# EAGLE design RP_Watchy (EAGLE 9.5.2)

## Sheet 1 of 3
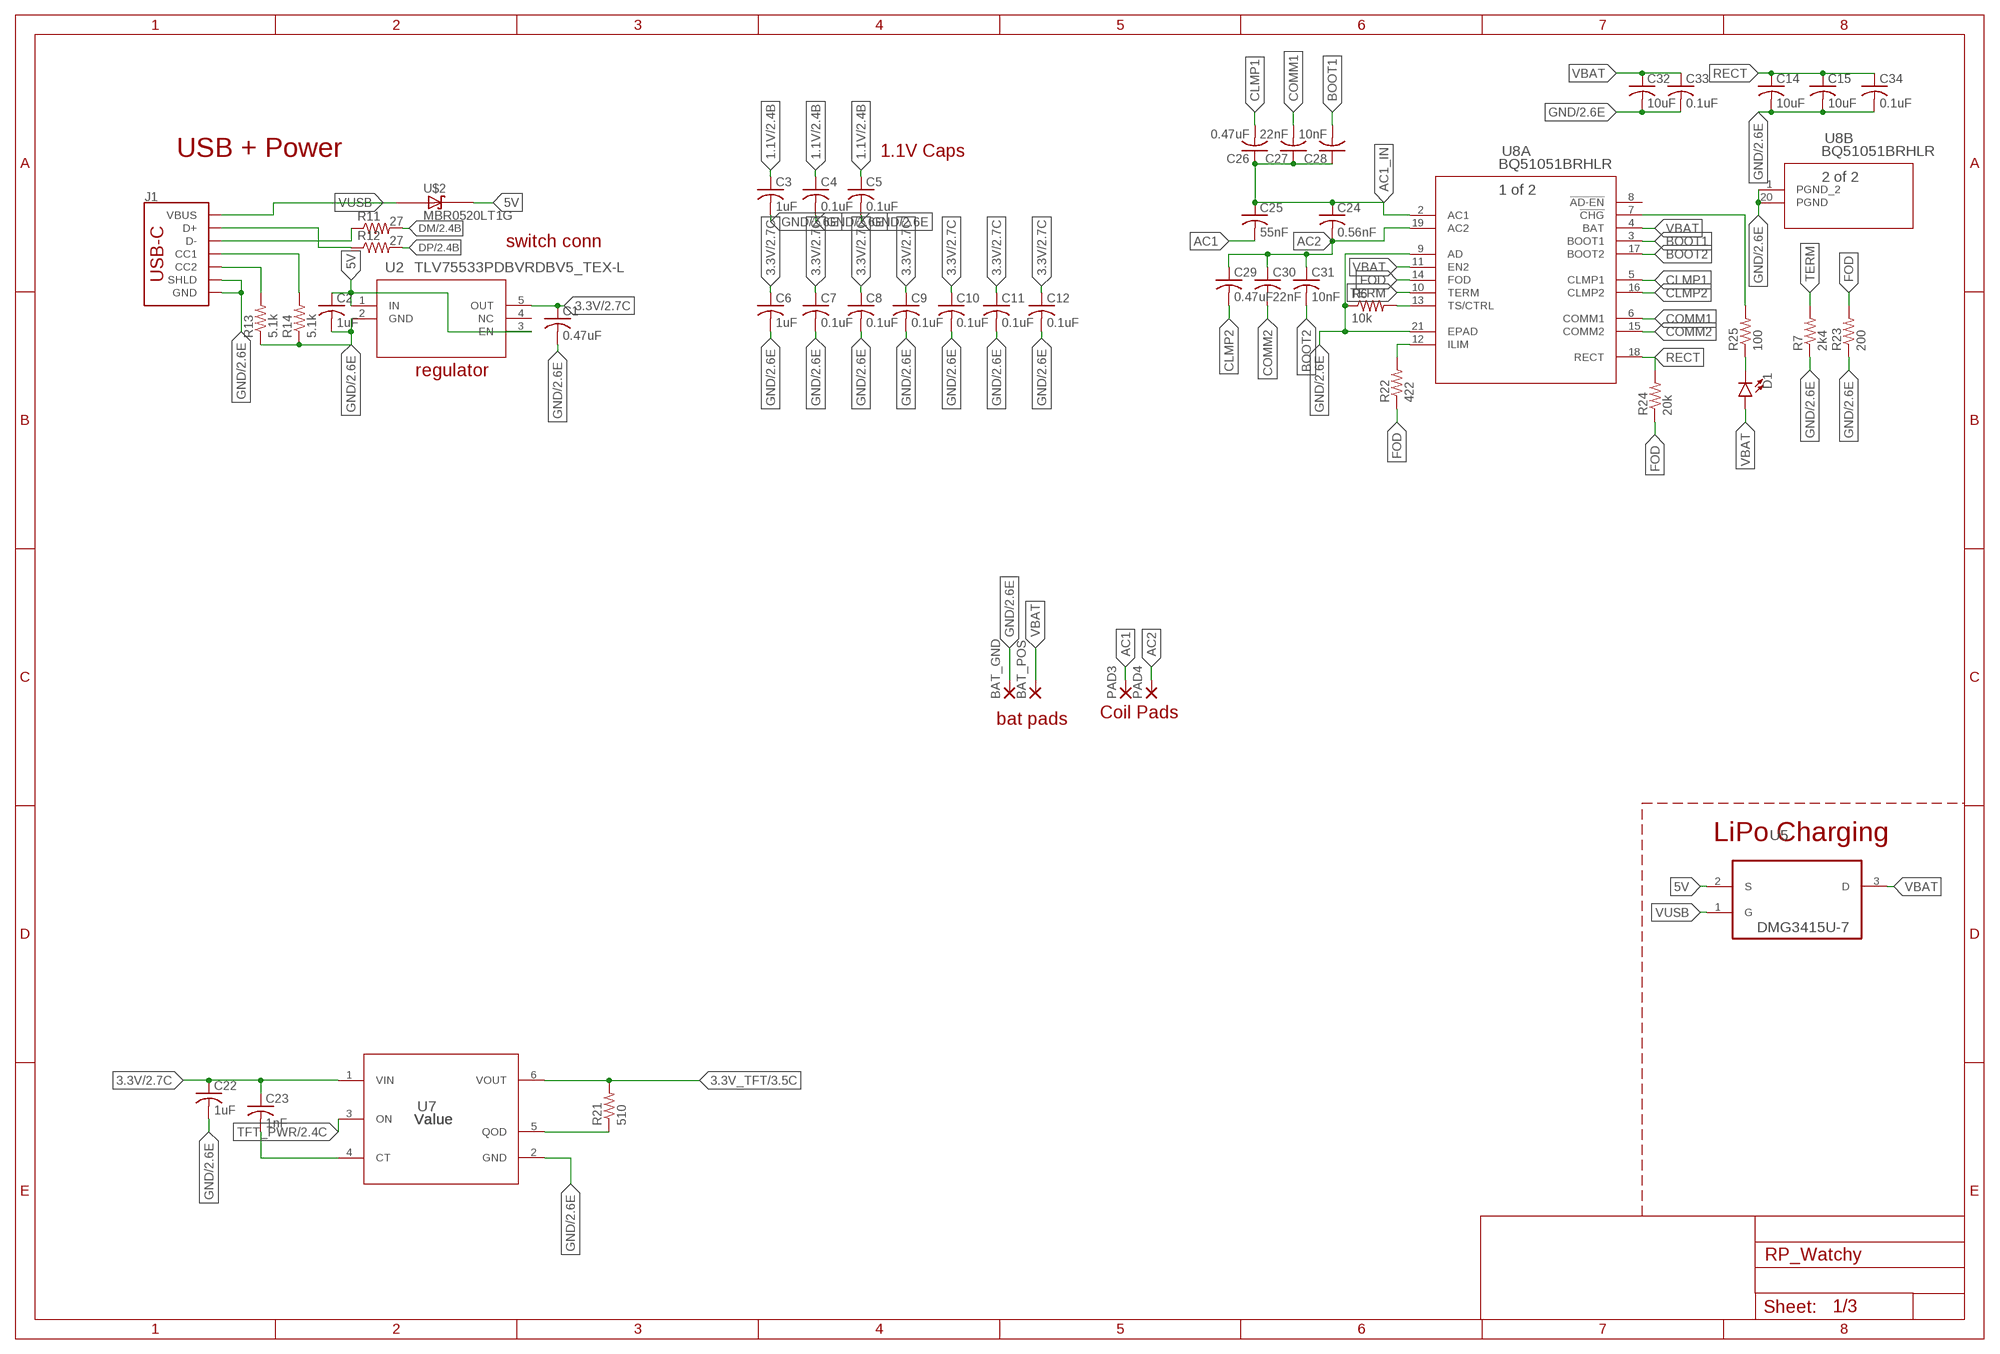
[diagram p0: schematic, sheet 1]

### Parts
BAT_GND  SMD2  [SMD1,27-2,54]
BAT_POS  SMD2  [SMD1,27-2,54]
C1  0.47uF  C-USC0402  [C0402]
C2  1uF  C-USC0402  [C0402]
C3  1uF  C-USC0402  [C0402]
C4  0.1uF  C-USC0402  [C0402]
C5  0.1uF  C-USC0402  [C0402]
C6  1uF  C-USC0402  [C0402]
C7  0.1uF  C-USC0402  [C0402]
C8  0.1uF  C-USC0402  [C0402]
C9  0.1uF  C-USC0402  [C0402]
C10  0.1uF  C-USC0402  [C0402]
C11  0.1uF  C-USC0402  [C0402]
C12  0.1uF  C-USC0402  [C0402]
C14  10uF  C-USC0402  [C0402]
C15  10uF  C-USC0402  [C0402]
C22  1uF  C-USC0402  [C0402]
C23  1nF  C-USC0402  [C0402]
C24  0.56nF  C-USC0603  [C0603]
C25  55nF  C-USC0603  [C0603]
C26  0.47uF  C-USC0402  [C0402]
C27  22nF  C-USC0402  [C0402]
C28  10nF  C-USC0402  [C0402]
C29  0.47uF  C-USC0402  [C0402]
C30  22nF  C-USC0402  [C0402]
C31  10nF  C-USC0402  [C0402]
C32  10uF  C-USC0402  [C0402]
C33  0.1uF  C-USC0402  [C0402]
C34  0.1uF  C-USC0402  [C0402]
D1  LED0603  [LED-0603]
J1  USB_C_2-LAYER_PADS  [USB-C-16P-2LAYER-PADS]
PAD3  SMD2  [SMD1,27-2,54]
PAD4  SMD2  [SMD1,27-2,54]
R6  10k  R-US_R0402  [R0402]
R7  2k4  R-US_R0402  [R0402]
R11  27  R-US_R0603  [R0603]
R12  27  R-US_R0603  [R0603]
R13  5.1k  R-US_R0603  [R0603]
R14  5.1k  R-US_R0603  [R0603]
R21  510  R-US_R0402  [R0402]
R22  422  R-US_R0402  [R0402]
R23  200  R-US_R0402  [R0402]
R24  20k  R-US_R0402  [R0402]
R25  100  R-US_R0402  [R0402]
U2  TLV75533PDBVRDBV5_TEX-L  [DBV5_TEX-L]
U5  DMG3415U-7  [SOT95P240X105-3N]
U7  Value  TPS22917DBVRDBV0006_L  [DBV0006_L]
U8  BQ51051BRHLR  [RHL20_2P05X3P05]
U$2  MBR0520LT1G  [SOD3716X117(SOD-123)]

### Nets
1.1V: C3.1 C4.1 C5.1 ; also sheet 2
3.3V: C1.1 C6.1 C7.1 C8.1 C9.1 C10.1 C11.1 C12.1 C22.1 C23.1 U2.5(OUT) U7.1(VIN) ; also sheet 2
3.3V_TFT: R21.2 U7.6(VOUT) ; also sheet 3
5V: C2.1 U2.1(IN) U2.3(EN) U5.2(S) U$2.1(C)
AC1: C25.2 PAD3.1(P)
AC1_IN: C24.1 C25.1 C26.1 C27.1 C28.1 U8.2(A:AC1)
AC2: C24.2 C29.1 C30.1 C31.1 PAD4.1(P) U8.19(A:AC2)
BOOT1: C28.2 U8.3(A:BOOT1)
BOOT2: C31.2 U8.17(A:BOOT2)
CLMP1: C26.2 U8.5(A:CLMP1)
CLMP2: C29.2 U8.16(A:CLMP2)
COMM1: C27.2 U8.6(A:COMM1)
COMM2: C30.2 U8.15(A:COMM2)
DM: R11.2 ; also sheet 2
DP: R12.2 ; also sheet 2
FOD: R22.1 R23.2 R24.1 U8.14(A:FOD)
GND: BAT_GND.1(P) C1.2 C2.2 C3.2 C4.2 C5.2 C6.2 C7.2 C8.2 C9.2 C10.2 C11.2 C12.2 C14.2 C15.2 C22.2 C32.2 C33.2 C34.2 J1.GND J1.GND2(GND) J1.P$1(SHLD) J1.P$2(SHLD) J1.P$3(SHLD) J1.P$4(SHLD) J1.SHLD1(SHLD) J1.SHLD2(SHLD) J1.SHLD3(SHLD) J1.SHLD4(SHLD) R6.1 R7.1 R13.1 R14.1 R23.1 U2.2(GND) U7.2(GND) U8.1(B:PGND_2) U8.9(A:AD) U8.20(B:PGND) U8.21(A:EPAD) ; also sheet 2,3
N$1: R6.2 U8.13(A:TS/CTRL)
N$3: J1.A5(CC1) R14.2
N$4: J1.B5(CC2) R13.2
N$7: C23.2 U7.4(CT)
N$8: R21.1 U7.5(QOD)
N$9: R22.2 U8.12(A:ILIM)
N$10: J1.A7(D-) J1.B7(D-) R11.1
N$11: J1.A6(D+) J1.B6(D+) R12.1
N$12: R25.2 U8.7(A:!CHG)
N$13: D1.C R25.1
RECT: C14.1 C15.1 C34.1 R24.2 U8.18(A:RECT)
TERM: R7.2 U8.10(A:TERM)
TFT_PWR: U7.3(ON) ; also sheet 2
VBAT: BAT_POS.1(P) C32.1 C33.1 D1.A U5.3(D) U8.4(A:BAT) U8.11(A:EN2)
VUSB: J1.VBUS1(VBUS) J1.VBUS2(VBUS) U5.1(G) U$2.2(A)
Unconnected: U2.4(NC) U8.8(A:!AD-EN)

### Notes on the sheet
- USB + Power | 1.1V Caps
- switch conn
- regulator
- Coil Pads
- bat pads
- LiPo Charging

## Sheet 2 of 3
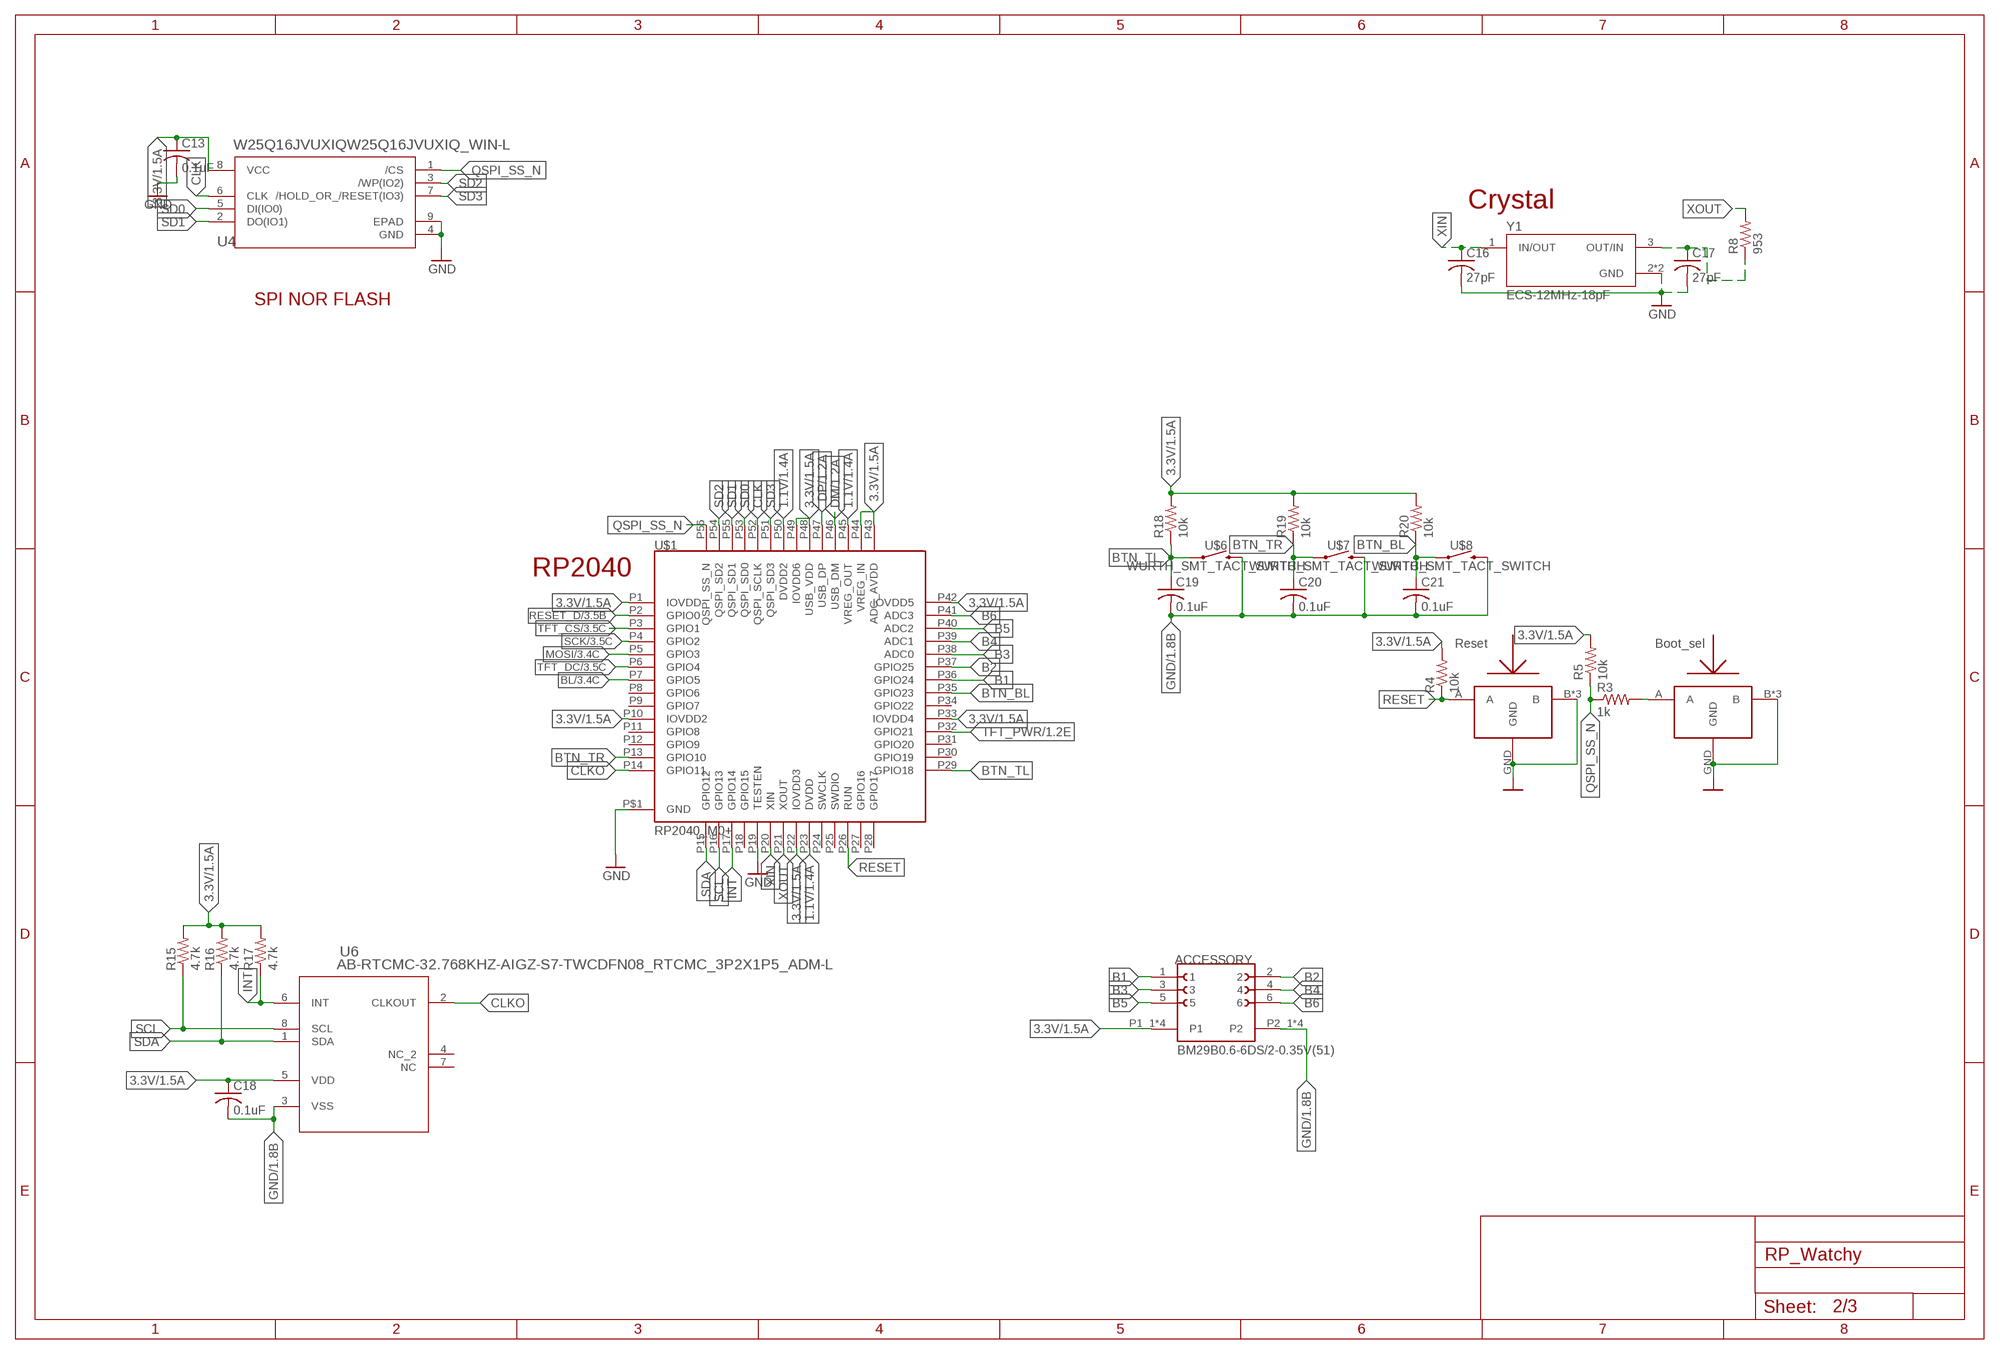
[diagram p1: schematic, sheet 2]

### Parts
ACCESSORY  BM29B0.6-6DS/2-0.35V(51)  [HRS_BM29B0.6-6DS/2-0.35V(51)]
C13  0.1uF  C-USC0402  [C0402]
C16  27pF  C-USC0402  [C0402]
C17  27pF  C-USC0402  [C0402]
C18  0.1uF  C-USC0402  [C0402]
C19  0.1uF  C-USC0402  [C0402]
C20  0.1uF  C-USC0402  [C0402]
C21  0.1uF  C-USC0402  [C0402]
R3  1k  R-US_R0402  [R0402]
R4  10k  R-US_R0402  [R0402]
R5  10k  R-US_R0402  [R0402]
R8  953  R-US_R0402  [R0402]
R15  4.7k  R-US_R0402  [R0402]
R16  4.7k  R-US_R0402  [R0402]
R17  4.7k  R-US_R0402  [R0402]
R18  10k  R-US_R0402  [R0402]
R19  10k  R-US_R0402  [R0402]
R20  10k  R-US_R0402  [R0402]
U4  W25Q16JVUXIQW25Q16JVUXIQ_WIN-L  [W25Q16JVUXIQ_WIN-L]
U6  AB-RTCMC-32.768KHZ-AIGZ-S7-TWCDFN08_RTCMC_3P2X1P5_ADM-L  [WCDFN08_RTCMC_3P2X1P5_ADM-L]
U$1  RP2040_M0+  [QFN-56]
U$4  SOF-232HST  [3.3X2.9]
U$5  SOF-232HST  [3.3X2.9]
U$6  WURTH_SMT_TACT_SWITCH  [SIDE_MOUNT_SWITCH]
U$7  WURTH_SMT_TACT_SWITCH  [SIDE_MOUNT_SWITCH]
U$8  WURTH_SMT_TACT_SWITCH  [SIDE_MOUNT_SWITCH]
Y1  ECS-12MHz-18pF  ECS-327ATQMV-AS-TR  [XTAL_ECS-327ATQMV-AS-TR]

### Nets
1.1V: U$1.P23(DVDD) U$1.P45(VREG_OUT) U$1.P50(DVDD2) ; also sheet 1
3.3V: ACCESSORY.P1_1(P1) ACCESSORY.P1_2(P1) ACCESSORY.P1_3(P1) ACCESSORY.P1_4(P1) C13.1 C18.1 R4.2 R5.2 R15.2 R16.2 R17.2 R18.2 R19.2 R20.2 U4.8(VCC) U6.5(VDD) U$1.P1(IOVDD) U$1.P10(IOVDD2) U$1.P22(IOVDD3) U$1.P33(IOVDD4) U$1.P42(IOVDD5) U$1.P43(ADC_AVDD) U$1.P44(VREG_IN) U$1.P48(USB_VDD) U$1.P49(IOVDD6) ; also sheet 1
B1: ACCESSORY.1 U$1.P36(GPIO24)
B2: ACCESSORY.2 U$1.P37(GPIO25)
B3: ACCESSORY.3 U$1.P38(ADC0)
B4: ACCESSORY.4 U$1.P39(ADC1)
B5: ACCESSORY.5 U$1.P40(ADC2)
B6: ACCESSORY.6 U$1.P41(ADC3)
BL: U$1.P7(GPIO5) ; also sheet 3
BTN_BL: C21.1 R20.1 U$1.P35(GPIO23) U$8.1
BTN_TL: C19.1 R18.1 U$1.P29(GPIO18) U$6.1
BTN_TR: C20.1 R19.1 U$1.P13(GPIO10) U$7.1
CLK: U4.6(CLK) U$1.P52(QSPI_SCLK)
CLKO: U6.2(CLKOUT) U$1.P14(GPIO11)
DM: U$1.P46(USB_DM) ; also sheet 1
DP: U$1.P47(USB_DP) ; also sheet 1
GND: ACCESSORY.P2_1(P2) ACCESSORY.P2_2(P2) ACCESSORY.P2_3(P2) ACCESSORY.P2_4(P2) C13.2 C16.2 C17.2 C18.2 C19.2 C20.2 C21.2 U4.4(GND) U4.9(EPAD) U6.3(VSS) U$1.P19(TESTEN) U$1.P$1(GND) U$4.B U$4.B2(B) U$4.B3(B) U$4.GND U$5.B U$5.B2(B) U$5.B3(B) U$5.GND U$6.2 U$7.2 U$8.2 Y1.2(GND) Y1.4(GND) ; also sheet 1,3
INT: R17.1 U6.6(INT) U$1.P17(GPIO14)
MOSI: U$1.P5(GPIO3) ; also sheet 3
N$2: R3.2 U$5.A
N$6: C17.1 R8.1 Y1.3(OUT/IN)
QSPI_SS_N: R3.1 R5.1 U4.1(/CS) U$1.P56(QSPI_SS_N)
RESET: R4.1 U$1.P26(RUN) U$4.A
RESET_D: U$1.P2(GPIO0) ; also sheet 3
SCK: U$1.P4(GPIO2) ; also sheet 3
SCL: R15.1 U6.8(SCL) U$1.P16(GPIO13)
SD0: U4.5(DI(IO0)) U$1.P53(QSPI_SD0)
SD1: U4.2(DO(IO1)) U$1.P55(QSPI_SD1)
SD2: U4.3(/WP(IO2)) U$1.P54(QSPI_SD2)
SD3: U4.7(/HOLD_OR_/RESET(IO3)) U$1.P51(QSPI_SD3)
SDA: R16.1 U6.1(SDA) U$1.P15(GPIO12)
TFT_CS: U$1.P3(GPIO1) ; also sheet 3
TFT_DC: U$1.P6(GPIO4) ; also sheet 3
TFT_PWR: U$1.P32(GPIO21) ; also sheet 1
XIN: C16.1 U$1.P20(XIN) Y1.1(IN/OUT)
XOUT: R8.2 U$1.P21(XOUT)
Unconnected: U6.4(NC_2) U6.7(NC) U$1.P8(GPIO6) U$1.P9(GPIO7) U$1.P11(GPIO8) U$1.P12(GPIO9) U$1.P18(GPIO15) U$1.P24(SWCLK) U$1.P25(SWDIO) U$1.P27(GPIO16) U$1.P28(GPIO17) U$1.P30(GPIO19) U$1.P31(GPIO20) U$1.P34(GPIO22)

### Notes on the sheet
- Crystal
- SPI NOR FLASH
- RP2040
- Reset | Boot_sel

## Sheet 3 of 3
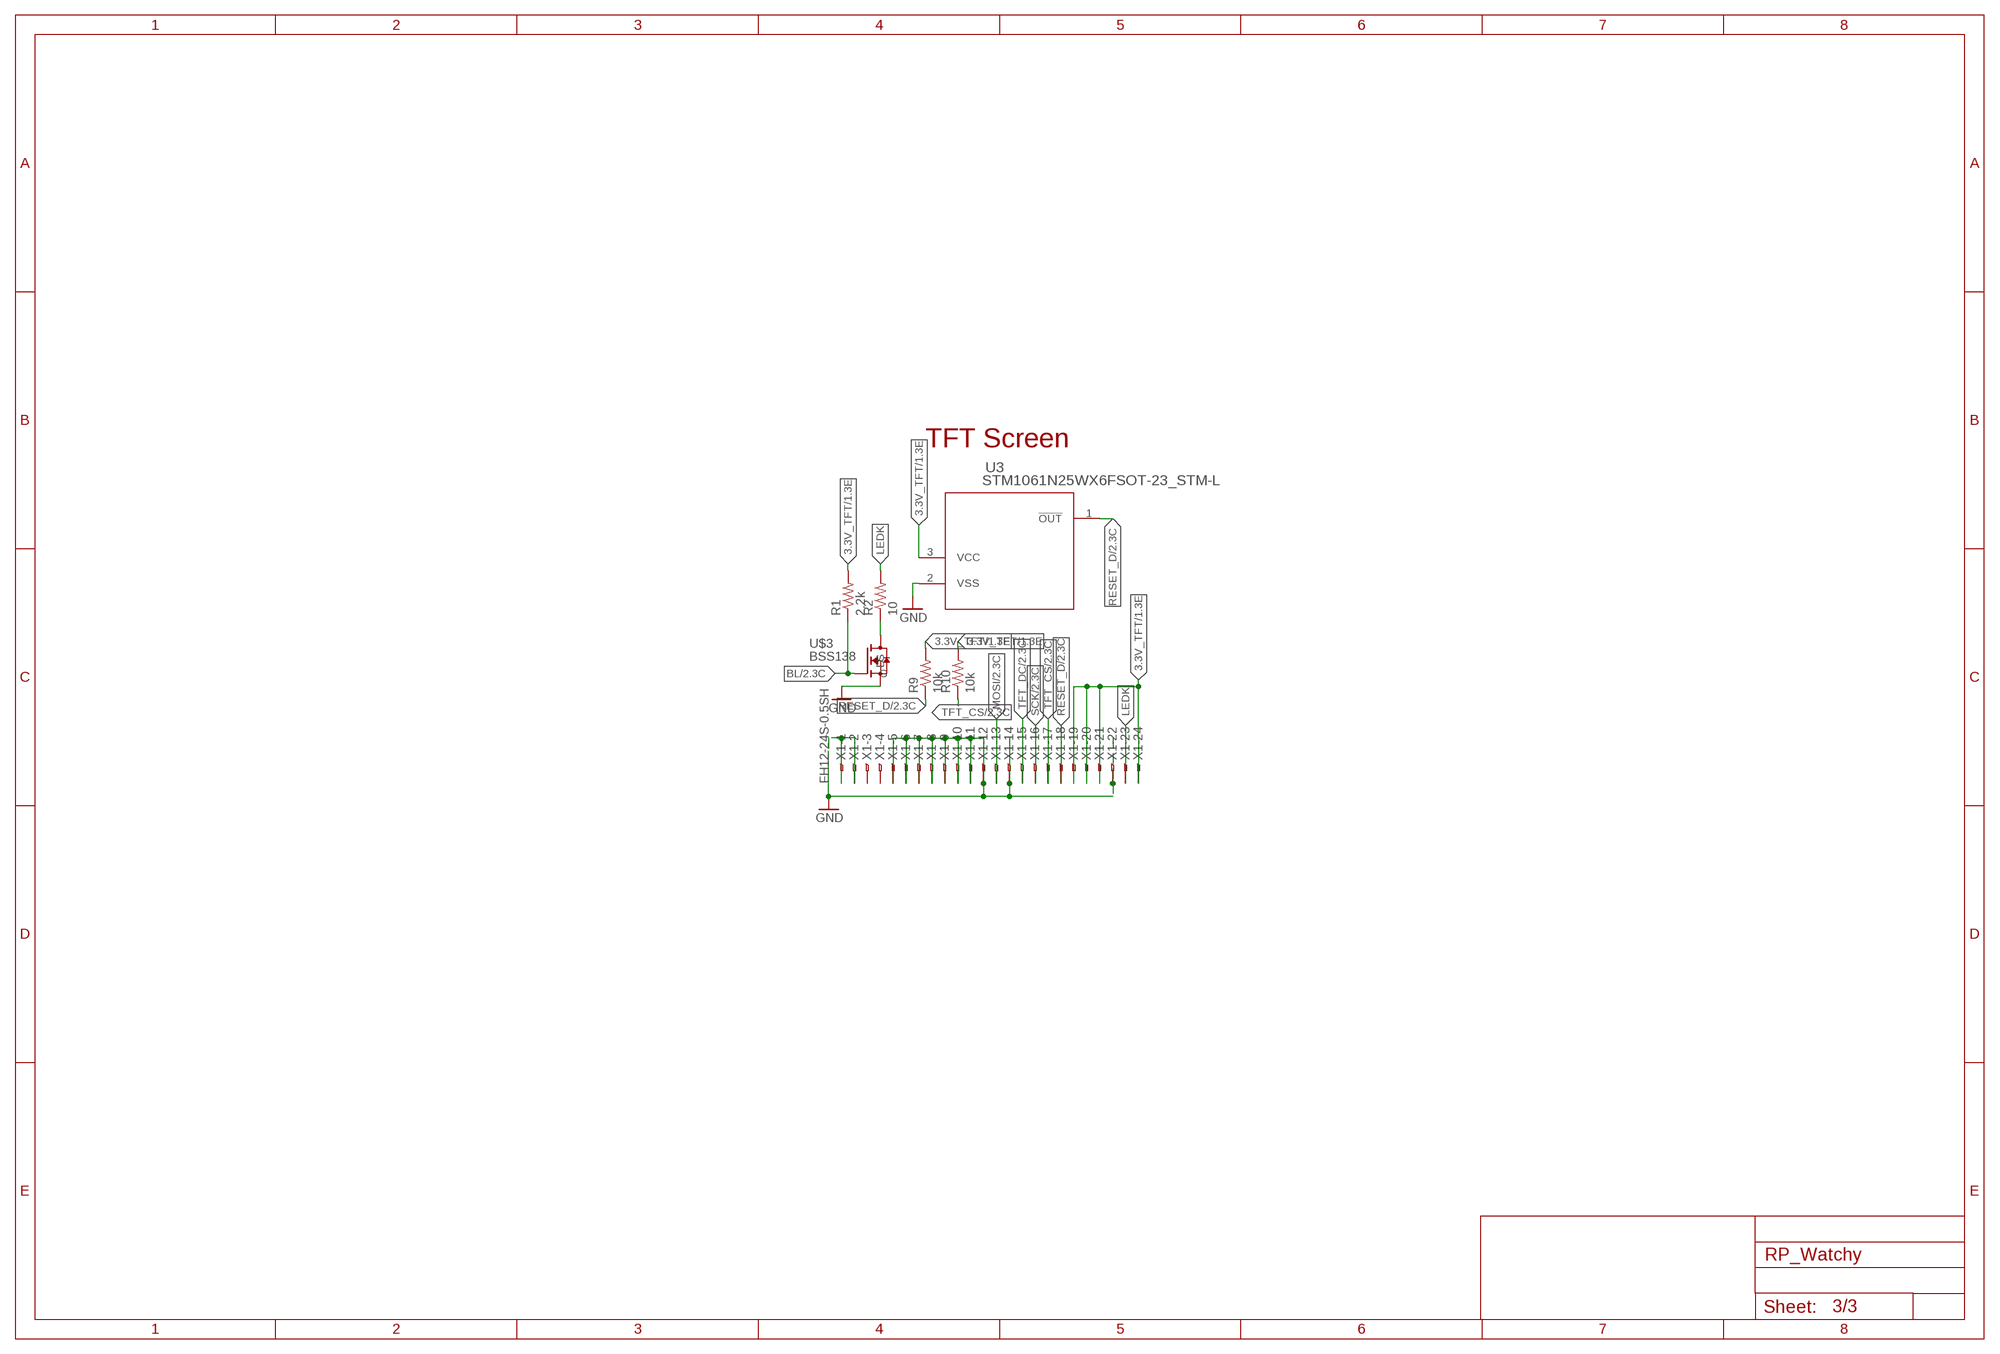
[diagram p2: schematic, sheet 3]

### Parts
R1  2.2k  R-US_R0603  [R0603]
R2  10  R-US_R0402  [R0402]
R9  10k  R-US_R0402  [R0402]
R10  10k  R-US_R0402  [R0402]
U3  STM1061N25WX6FSOT-23_STM-L  [SOT-23_STM-L]
U$3  BSS138  [BSS138]
X1  FH12-24S-0.5SH  [FH12-24S-0.5SH]

### Nets
3.3V_TFT: R1.2 R9.2 R10.2 U3.3(VCC) X1.19 X1.20 X1.21 X1.24 ; also sheet 1
BL: R1.1 U$3.G ; also sheet 2
GND: U3.2(VSS) U$3.S X1.1 X1.2 X1.5 X1.6 X1.7 X1.8 X1.9 X1.10 X1.11 X1.12 X1.14 X1.22 ; also sheet 1,2
LEDK: R2.2 X1.23
MOSI: X1.13 ; also sheet 2
N$5: R2.1 U$3.D
RESET_D: R9.1 U3.1(!OUT) X1.18 ; also sheet 2
SCK: X1.16 ; also sheet 2
TFT_CS: R10.1 X1.17 ; also sheet 2
TFT_DC: X1.15 ; also sheet 2
Unconnected: X1.3 X1.4

### Notes on the sheet
- TFT Screen

## Library data of the parts
ACCESSORY = BM29B0.6-6DS_2-0.35V_51_:BM29B0.6-6DS/2-0.35V(51); DESCRIPTION: 8 (6 + 2 Power) Position Connector Receptacle, Center Strip Contacts Surface Mount Gold; DIGI-KEY_PART_NUMBER: 26-BM29B0.6-6DS/2-0.35V(51)TR-ND; MF: Hirose Connector; MP: BM29B0.6-6DS/2-0.35V(51); PACKAGE: None; PURCHASE-URL: https://pricing.snapeda.com/search/part/BM29B0.6-6DS/2-0.35V(51)/?ref=eda
BAT_GND BAT_POS PAD3 PAD4 = wirepad:SMD2: SMD PAD
C1-C13 C16-C23 = rcl:C-US: CAPACITOR, American symbol; SPICEPREFIX: C
C14 C15 C24-C34 = adafruit:C-US: CAPACITOR, American symbol
D1 = SparkFun-LED:LED: LED (Generic) Standard schematic elements and footprints for 5mm, 3mm, 1206, and 0603 sized LEDs. Generic LEDs with no color specified.
J1 = SparkFun-Connectors:USB_C: USB Type C 16Pin Connector Super Speed pins not available on the 16-pin purely SMD connector so this part is best for USB 2.0 implementations. D1 and D2 are tied together enabling D+/- no matter which way the cable is plugged into the connector. The two channel configuration pins (CC1/2) are exposed. These are normally connected to ground via 5.1k resistors but can be reconfigured for high current/high power applications.; PROD_ID: CONN-14122
R1-R25 = rcl:R-US_: RESISTOR, American symbol; SPICEPREFIX: R
U2 = TLV75533pdbvr:TLV75533PDBVR; COPYRIGHT: Copyright (C) 2018 Accelerated Designs. All rights reserved; MANUFACTURER_PART_NUMBER: TLV75533PDBVR; SOURCELIBRARY: TI_2019-06-18; VENDOR: Texas Instruments
U3 = STM Devices:STM1061N25WX6F; COPYRIGHT: Copyright (C) 2021 Ultra Librarian. All rights reserved.; DIGI-KEY_PART_NUMBER_1: 1026-STM1061N25WX6F-CHP; DIGI-KEY_PART_NUMBER_2: 497-6181-1-ND; DIGI-KEY_PART_NUMBER_3: 497-6181-2-ND; DIGI-KEY_PART_NUMBER_4: 497-6181-6-ND; MANUFACTURER_PART_NUMBER: STM1061N25WX6F; MFR_NAME: STMicroelectronics
U4 = Winbond SPI Flash:W25Q16JVUXIQ; BUILT_BY: EMA_Colton; COPYRIGHT: Copyright (C) 2018 Accelerated Designs. All rights reserved; DATASHEET: https://www.mouser.com/datasheet/2/949/w25n01gw_reve_021318_unsecured-1489855.pdf; MANUFACTURER_PART_NUMBER: W25Q16JVUXIQ; SOURCELIBRARY: Winbond_2020-03-18; VENDOR: Winbond
U5 = DMG3415U-7:DMG3415U-7: P-CHANNEL ENHANCEMENT MODE MOSFET; AVAILABILITY: Unavailable; DESCRIPTION: P-Channel 20V 4A _Ta_ 900mW _Ta_ Surface Mount SOT-23-3; MF: Diodes Inc.; MP: DMG3415U-7; PACKAGE: SOT-23-3 Diodes Inc.; PRICE: None
U6 = Abracon RTC:AB-RTCMC-32.768KHZ-AIGZ-S7-T; COPYRIGHT: Copyright (C) 2022 Ultra Librarian. All rights reserved.; DIGI-KEY_PART_NUMBER_1: 535-12052-2-ND; DIGI-KEY_PART_NUMBER_2: 535-12052-1-ND; DIGI-KEY_PART_NUMBER_3: 535-12052-6-ND; DIGI-KEY_PART_NUMBER_4: 535-12052-2-NDL; MANUFACTURER_PART_NUMBER: AB-RTCMC-32.768KHZ-AIGZ-S7-T; MFR_NAME: Abracon
U7 = TPS22917DBVR:TPS22917DBVR; MANUFACTURER: Texas Instruments; PARTNUMBER: TPS22917DBVR; REFDES: RefDes; TYPE: TYPE
U8 = BQ51051BRHLR:BQ51051BRHLR; COPYRIGHT: Copyright (C) 2022 Ultra Librarian. All rights reserved.; MANUFACTURER_PART_NUMBER: BQ51051BRHLR; MFR_NAME: Texas Instruments
U$1 = RP2040_M0:RP2040_M0+
U$2 = MBR0520LT1G:MBR0520LT1G: Surface Mount Schottky Power Rectifier Plastic SOD−123 Package; AVAILABILITY: Unavailable; DESCRIPTION: Diode Schottky 20V 500mA Surface Mount SOD-123; MF: ON Semiconductor; MP: MBR0520LT1G; PACKAGE: SOD-123 ON Semiconductor; PRICE: None
U$3 = BSS138:BSS138: BSS138 N-Channel Logic Level Enhancement Mode Field Effect Transistor; AVAILABILITY: Unavailable; DESCRIPTION: N-Channel 50V 220mA _Ta_ 360mW _Ta_ Surface Mount Die; MF: MICROSS/On Semiconductor; MP: BSS138; PACKAGE: TO-236-3 Micross; PRICE: None
U$4 U$5 = Mitsumi Buttons:SOF-232HST
U$6-U$8 = Wurth Switches:WURTH_SMT_TACT_SWITCH
X1 = con-hirose:FH12-24S-0.5S: 0.5mm Pitch Connectors For FPC/FFC Source: Data sheet <http://www.hirose.co.jp/cataloge_hp/e58605370.pdf>; MPN: FH12-24S-0.5SH(55); OC_FARNELL: 1324552; OC_NEWARK: 34M6170
Y1 = ECS-327ATQMV-AS-TR:ECS-327ATQMV-AS-TR: The ECX-33Q is a miniature SMD Crystal with a 3.2 x 2.5 mm footprint. AEC-Q200 Qualified.; ARROW_ELECTRONICS-PURCHASE-URL: https://snapeda.com/shop?store=Arrow+Electronics&id=3210300; DESCRIPTION: 32.768kHz XO (Standard) CMOS Oscillator 1.62V ~ 3.63V Enable/Disable 4-SMD, No Lead; DIGI-KEY_PART_NUMBER: XC2826CT-ND; MF: ECS Inc.; MOUSER-PURCHASE-URL: https://snapeda.com/shop?store=Mouser&id=3210300; MP: ECS-327ATQMV-AS-TR; PACKAGE: SMD-4 ECS Inc.

## Board
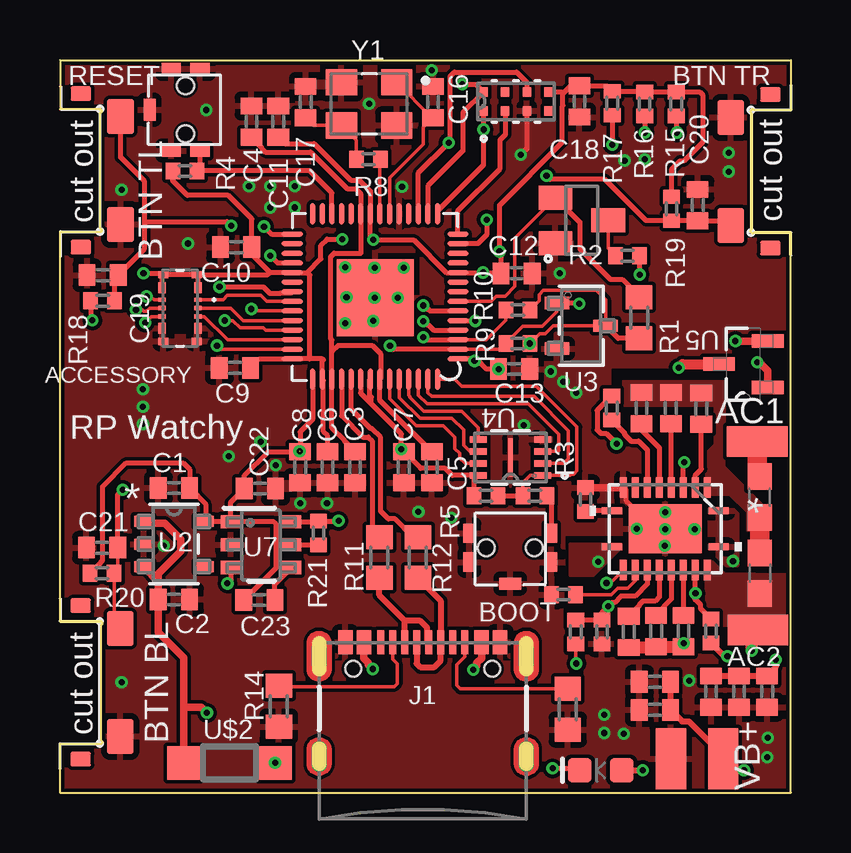
[diagram p3: board, top side]
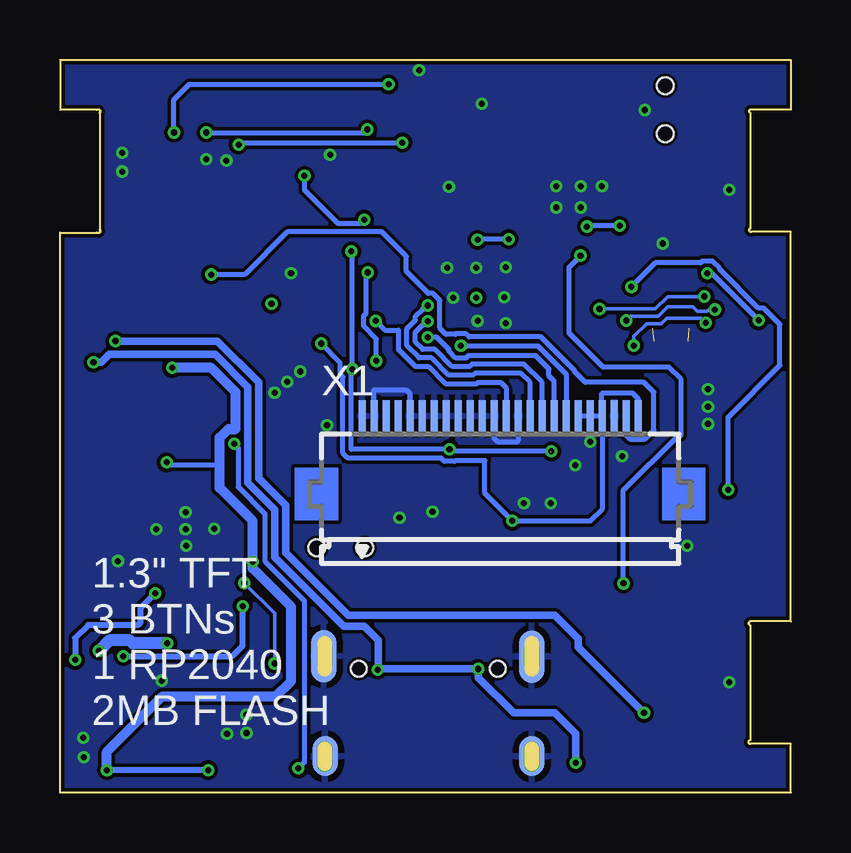
[diagram p4: board, bottom side, seen from below]

Size 30.45 x 30.53 mm. Coordinates in mm from the lower left corner, seen from the top.
Outline: 0,0 0,2.03 1.68,2.03 arc180 1.7,2.18 1.7,6.99 arc180 1.68,7.14 0,7.14 0,23.37 1.65,23.37 arc180 1.68,23.52 1.68,28.32 arc180 1.65,28.47 0,28.47 0,30.53 30.45,30.53 30.45,28.45 28.93,28.45 arc180 28.8,28.32 28.8,23.47 arc180 28.93,23.34 30.45,23.34 30.45,0 0,0
Copper layers (1*16): Top 0.035mm / dielectric 1.5mm / Bottom 0.035mm
Design rules "default *": minimum track width 6mil, minimum drill 10mil, track to track 6mil, track to pad 6mil, pad to pad 6mil, via to via 6mil, smd to smd 6mil, copper to edge 6mil, drill to drill 6mil, minimum pad ring 5mil, minimum via ring 5mil, stop-mask expansion 1mil, vias tented up to drill 12mil, thermal gap 10mil

### Footprints (pad centres in the part's own frame; a part is rotated, then mirrored left to right if it is on the bottom)
HRS_BM29B0.6-6DS/2-0.35V(51) = smd 0.18 x 0.32: 1 0.35,-0.75; 2 0.35,0.75; 3 0,-0.75; 4 0,0.75; 5 -0.35,-0.75; 6 -0.35,0.75 | smd 0.46 x 0.32: P1_1 0.84,-0.75; P1_2 0.84,0.75; P2_1 -0.84,-0.75; P2_2 -0.84,0.75 | smd 0.3 x 0.42: P1_3 1.39,-0.7; P1_4 1.39,0.7; P2_3 -1.39,-0.7; P2_4 -1.39,0.7
SMD1,27-2,54 = smd 1.27 x 2.54: 1 0,0
C0402 = smd 0.7 x 0.9: 1 -0.65,0; 2 0.65,0
C0603 = smd 1.1 x 1: 1 -0.85,0; 2 0.85,0
LED-0603 = smd 1 x 1: A -0.877,0; C 0.877,0
USB-C-16P-2LAYER-PADS = smd 0.3 x 1: A5 -1.25,-0.34; A6 -0.25,-0.34; A7 0.25,-0.34; A8 1.25,-0.34; B5 1.75,-0.34; B6 0.75,-0.34; B7 -0.75,-0.34; B8 -1.75,-0.34 | smd 0.6 x 1: GND -3.225,-0.34; GND2 3.225,-0.34; VBUS1 -2.45,-0.34; VBUS2 2.45,-0.34 | smd 1.067 x 2.184 bottom: P$1 -4.318,-0.94; P$2 4.343,-0.914 | smd 1.067 x 1.676 bottom: P$3 -4.318,-5.08; P$4 4.293,-5.08 | drill 0.4 pad 0.6 long: SHLD1 -4.318,-0.915; SHLD2 4.318,-0.915; SHLD3 -4.318,-5.095; SHLD4 4.318,-5.095 | hole 0.65: -2.89,-1.445; 2.89,-1.445
R0603 = smd 1 x 1.1: 1 -0.85,0; 2 0.85,0
R0402 = smd 0.6 x 0.7: 1 -0.5,0; 2 0.5,0
DBV5_TEX-L = smd 0.775 x 0.457: 1 -1.264,0.95; 2 -1.264,0; 3 -1.264,-0.95; 4 1.264,-0.95; 5 1.264,0.95
SOT-23_STM-L = smd 0.508 x 1.016: 1 -0.95,-1.016; 2 0.95,-1.016; 3 0,1.016
W25Q16JVUXIQ_WIN-L = smd 0.711 x 0.254: 1 -1.348,0.75; 2 -1.348,0.25; 3 -1.348,-0.25; 4 -1.348,-0.75; 5 1.348,-0.75; 6 1.348,-0.25; 7 1.348,0.25; 8 1.348,0.75 | smd 0.203 x 1.6: 9 0,0
SOT95P240X105-3N = smd 1.321 x 0.559: 1 -1.016,0.965; 2 -1.016,-0.965; 3 1.016,0
WCDFN08_RTCMC_3P2X1P5_ADM-L = smd 0.406 x 0.356: 1 -0.394,1.35; 2 -0.394,0.45; 3 -0.394,-0.45; 4 -0.394,-1.35; 5 0.394,-1.35; 6 0.394,-0.45; 7 0.394,0.45; 8 0.394,1.35
DBV0006_L = smd 0.8 x 0.55: 1 -1.275,0.95; 2 -1.275,0; 3 -1.275,-0.95; 4 1.275,-0.95; 5 1.275,0; 6 1.275,0.95
RHL20_2P05X3P05 = smd 0.28 x 0.85: 1 -0.75,2.225; 10 -0.75,-2.225; 11 0.75,-2.225; 20 0.75,2.225 | smd 0.85 x 0.28: 2 -1.725,1.75; 3 -1.725,1.25; 4 -1.725,0.75; 5 -1.725,0.25; 6 -1.725,-0.25; 7 -1.725,-0.75; 8 -1.725,-1.25; 9 -1.725,-1.75; 12 1.725,-1.75; 13 1.725,-1.25; 14 1.725,-0.75; 15 1.725,-0.25; 16 1.725,0.25; 17 1.725,0.75; 18 1.725,1.25; 19 1.725,1.75 | smd 2.05 x 3.05: 21 0,0
QFN-56 = smd 0.875 x 0.2: P1 -3.5,2.55; P2 -3.5,2.15; P3 -3.5,1.75; P4 -3.5,1.35; P5 -3.5,0.95; P6 -3.5,0.55; P7 -3.5,0.15; P8 -3.5,-0.25; P9 -3.5,-0.65; P10 -3.5,-1.05; P11 -3.5,-1.45; P12 -3.5,-1.85; P13 -3.5,-2.25; P14 -3.5,-2.65; P29 3.4,-2.65; P30 3.4,-2.25; P31 3.4,-1.85; P32 3.4,-1.45; P33 3.4,-1.05; P34 3.4,-0.65; P35 3.4,-0.25; P36 3.4,0.15; P37 3.4,0.55; P38 3.4,0.95; P39 3.4,1.35; P40 3.4,1.75; P41 3.4,2.15; P42 3.4,2.55 | smd 0.2 x 0.875: P15 -2.65,-3.5; P16 -2.25,-3.5; P17 -1.85,-3.5; P18 -1.45,-3.5; P19 -1.05,-3.5; P20 -0.65,-3.5; P21 -0.25,-3.5; P22 0.15,-3.5; P23 0.55,-3.5; P24 0.95,-3.5; P25 1.35,-3.5; P26 1.75,-3.5; P27 2.15,-3.5; P28 2.55,-3.5; P43 2.55,3.4; P44 2.15,3.4; P45 1.75,3.4; P46 1.35,3.4; P47 0.95,3.4; P48 0.55,3.4; P49 0.15,3.4; P50 -0.25,3.4; P51 -0.65,3.4; P52 -1.05,3.4; P53 -1.45,3.4; P54 -1.85,3.4; P55 -2.25,3.4; P56 -2.65,3.4 | smd 3.2 x 3.2: P$1 -0.05,0
SOD3716X117(SOD-123) = smd 1.4 x 1.4: 1 -1.9,0.051; 2 1.9,0.051
BSS138 = smd 1 x 1.4: D 0,1.1; G -0.95,-1.1; S 0.95,-1.1
3.3X2.9 = smd 0.5 x 0.8: A -0.7,-0.6; B2 2.7,0.6; B3 2.7,-0.6; GND -0.7,0.6 | smd 0.9 x 0.5: B 1,1.5 | hole 0.7: 0,0; 2,0
SIDE_MOUNT_SWITCH = smd 1.45 x 1.1: 1 -2.265,1.515; 2 2.235,1.515 | smd 0.6 x 0.85: 3 -3.215,-0.135; 4 3.185,-0.135
FH12-24S-0.5SH = smd 0.3 x 1.3: 1 -5.75,3.25; 2 -5.25,3.25; 3 -4.75,3.25; 4 -4.25,3.25; 5 -3.75,3.25; 6 -3.25,3.25; 7 -2.75,3.25; 8 -2.25,3.25; 9 -1.75,3.25; 10 -1.25,3.25; 11 -0.75,3.25; 12 -0.25,3.25; 13 0.25,3.25; 14 0.75,3.25; 15 1.25,3.25; 16 1.75,3.25; 17 2.25,3.25; 18 2.75,3.25; 19 3.25,3.25; 20 3.75,3.25; 21 4.25,3.25; 22 4.75,3.25; 23 5.25,3.25; 24 5.75,3.25
XTAL_ECS-327ATQMV-AS-TR = smd 1.3 x 1.1: 1 -1.15,-0.9; 2 1.15,-0.9; 3 1.15,0.9; 4 -1.15,0.9

### Placement (x,y rotation side)
ACCESSORY  5,20.19 90 top
BAT_GND  25.45,1.42 0 top
BAT_POS  27.64,1.42 0 top
C1  4.75,12.7 180 top
C2  4.75,8.05 0 top
C3  12.29,13.56 270 top
C4  7.98,27.97 90 top
C5  15.49,13.56 270 top
C6  11.15,13.56 270 top
C7  14.33,13.56 270 top
C8  10.01,13.56 270 top
C9  7.29,17.7 180 top
C10  7.34,22.73 180 top
C11  9.09,27.97 90 top
C12  19.02,21.64 0 top
C13  18.92,17.65 0 top
C14  28.3,4.22 270 top
C15  27.13,4.22 270 top
C16  15.54,28.78 90 top
C17  10.24,28.78 90 top
C18  21.64,28.8 270 top
C19  1.78,21.56 180 top
C20  26.57,24.49 90 top
C21  1.75,10.21 180 top
C22  8.33,12.67 0 top
C23  8.31,8.03 0 top
C24  29.16,9.14 270 top
C25  29.16,12.32 90 top
C26  25.45,16.03 270 top
C27  24.23,16.03 270 top
C28  26.72,16 270 top
C29  24.84,6.73 90 top
C30  23.7,6.71 90 top
C31  25.98,6.73 90 top
C32  24.79,4.62 180 top
C33  24.79,3.45 180 top
C34  29.46,4.22 270 top
D1  22.53,0.94 180 top
J1  15.11,6.6 0 top
PAD3  29.06,14.63 90 top
PAD4  29.08,6.78 90 top
R1  24.13,19.79 270 top
R2  23.65,22.38 0 top
R3  19.79,12.37 0 top
R4  5.21,25.91 180 top
R5  17.75,12.37 180 top
R6  20.98,8.26 0 top
R7  21.89,12.22 270 top
R8  12.85,26.39 0 top
R9  19.08,18.72 0 top
R10  19.08,20.12 0 top
R11  13.31,9.8 90 top
R12  14.91,9.8 90 top
R13  21.16,3.48 90 top
R14  9.12,3.61 90 top
R15  25.68,28.7 90 top
R16  24.36,28.7 90 top
R17  23.01,28.73 90 top
R18  1.78,20.5 180 top
R19  25.48,24.33 90 top
R20  1.75,9.14 180 top
R21  10.77,10.82 90 top
R22  21.49,6.71 270 top
R23  22.58,6.71 90 top
R24  27.13,6.73 90 top
R25  22.99,16.03 270 top
U2  4.75,10.36 0 top
U3  21.72,19.46 270 top
U4  18.77,13.97 180 top
U5  28.47,17.86 180 top
U6  19,28.8 90 top
U7  8.38,10.34 0 top
U8  25.22,11 270 top
U$1  13.08,20.62 180 top
U$2  7.06,1.19 0 top
U$3  21.74,23.85 270 top
U$4  5.23,27.46 90 top
U$5  19.76,10.21 180 top
U$6  1.01,25.92 270 top
U$7  29.46,25.91 90 top
U$8  0.99,4.58 270 top
X1  12.12,12.45 0 bottom
Y1  12.88,28.7 180 top

### Tracks (layer width: path | path; a pad name or v marks a point on that pad's centre or on a via)
1.1V
  Top 0.203: C5.1 14.75,14.96 14.72,14.96 13.33,16.35 U$1.P50 13.36,17.25 13.36,18.29 13.01,18.64 11.61,18.64 11.33,18.37 | C3.1 11.86,14.65 11.86,14.67 11.33,15.19 U$1.P45 11.33,18.37 | 11.33,18.37 11.33,18.87 11.28,18.92 11.28,22.33 11.43,22.48 12.55,22.48 12.55,24.11 U$1.P23 12.53,24.96 12.32,25.17 11.97,25.17 10.44,26.7 8.55,26.7 8.39,26.86 8.39,26.9 C4.1
3.3V  (via drill 0.25)  (1 unrouted)
  Top 0.203: C13.1 17.78,17.65 17.36,18.07 U$1.P1 17.2,18.07 v17.27,17.99 | R5.2 17.25,13.05 U4.8 16.35,13.22 16.05,13.52 15.02,13.52 C7.1 v14.22,14.31 14.22,14.95 12.97,16.2 | U$1.P49 12.9,17.2 12.9,16.56 12.97,16.49 12.97,16.2 | U$1.P48 12.53,16.65 12.97,16.2 | C6.1 11.15,14.87 10.97,15.04 10.97,17.18 U$1.P44 10.93,17.99 10.97,18.03 10.93,18.07 10.39,18.07 | U$1.P43 10.53,15.56 10.01,15.04 C8.1 8.68,14.21 7.68,13.22 C22.1 7.11,12.1 U7.1 | U2.5 6.07,11.31 | 6.07,11.31 7.08,11.31 U7.1 | 6.07,11.31 6.07,12.03 C1.1 5.4,13.47 5.13,13.74 2.77,13.74 1.78,12.75 1.78,9.68 1.7,9.6 1.7,9.59 R20.2 | C23.1 9,9.37 9,11.2 8.92,11.29 U7.1 | 10.39,18.07 U$1.P42 8.31,18.07 C9.1 | 10.3,21.68 U$1.P33 8.75,21.68 | 10.3,21.68 10.41,21.57 10.41,18.1 10.39,18.07 | 8.75,21.68 7.99,22.44 C10.1 7.99,23.91 7.01,24.89 5.31,24.89 4.71,25.49 R4.2 | 20.95,29.13 20.95,28.63 20.94,28.61 20.94,27.11 18.31,24.49 v18.31,22.55 18.38,22.49 C12.1 18.34,21.68 v17.63,21.68 U$1.P10 16.09,21.68 14.73,23.04 v13.06,23.04 12.93,23.16 U$1.P22 12.93,25.07 12.47,25.53 12.12,25.53 10.59,27.05 9.36,27.05 C11.1 | 20.95,29.13 20.89,29.2 U6.5 | 20.95,29.13 21.27,29.45 C18.1 22.79,29.45 R17.2 24.33,29.23 R16.2 R15.2 26.65,29.2 26.77,29.08 26.77,27.1 25.98,26.31 25.83,26.31 25.48,25.96 R19.2 | 10.3,21.68 10.87,22.24 10.87,22.81 11.12,23.06 v11.76,23.06 | ACCESSORY.P1_1 5.75,21.53 ACCESSORY.P1_3 | ACCESSORY.P1_2 4.25,21.53 | 4.25,21.53 ACCESSORY.P1_4 ACCESSORY.P1_3 | R18.2 1.28,19.75 v1.35,19.68 | v3.48,21.64 4.15,21.64 4.25,21.53 | ACCESSORY.P1_3 8.66,21.58 8.75,21.68
  Bottom 0.203: v9.98,14.22 14.13,14.22 v14.22,14.31 18.3,14.31 18.31,14.3 18.31,17.61 C13.1 18.27,22.52 v18.31,22.55 | v11.76,23.06 13.03,23.06 v13.06,23.04 | v17.27,17.99 17.27,18.92 17.8,19.45 17.8,19.87 17.7,19.97 17.7,21.6 v17.63,21.68 | v1.35,19.68 3.3,21.64 v3.48,21.64
  other vias: 18.27,17.65
3.3V_TFT  (via drill 0.25)
  Top 0.152: R10.2 19.96,20.51 19.96,20.75 20.14,20.93 22.35,20.93 22.73,20.55 U3.3 20.55,19.46 20.22,19.13 19.98,19.13 R9.2
  Top 0.203: U7.6 10.74,11.29 R21.2 v11.6,11.32 v11.61,11.33 | R1.2 23.25,18.94 U3.3
  Bottom 0.203: R9.2 18.78,17.93 18.78,17.44 18.67,17.33 18.67,14.15 18.46,13.95 14.57,13.95 14.43,13.81 14.01,13.81 13.98,13.84 12.75,13.84 12.75,12.47 v11.61,11.33 8.36,11.33 7.85,11.84 7.85,15.68 X1.21 | X1.21 X1.20 X1.19 | X1.21 7.87,16.64 7.85,16.66 6.6,16.66 6.37,16.42 X1.24
  other vias: 19.58,18.72
5V  (via drill 0.25)
  Top 0.305: U2.3 4.1,8.8 | 4.1,8.8 C2.1 4.1,6.7 5.16,5.63 5.16,3.56 | U2.1 3.57,11.23 4.37,11.23 5.03,10.57 5.03,10.06 4.1,9.13 4.1,8.8 | U$2.1 5.16,3.56 | 5.16,3.56 5.89,3.56 v6.12,3.33 | v28.14,18.82 U5.2
  Bottom 0.305: v6.12,3.33 8.87,6.07 8.87,6.43 9.83,7.39 18.44,7.39 21.06,10.01 21.06,11.99 22.17,13.11 22.17,17.09 23.9,18.82 v28.14,18.82
AC1
  Top 0.813: PAD3.1 29.06,13.27 C25.2
AC1_IN
  Top 0.813: C25.1 C24.1
  pour Top (no thermals): 29.64,10.97 29.62,11 29.62,11.99 29.59,11.96 29.29,11.96 27.66,13.59 27.66,15.39 27.69,15.42 27.69,17.09 27.66,17.12 23.52,17.12 23.5,17.14 23.5,16.15 27.25,16.15 27.3,16.1 27.3,14.5 26.95,14.15 26.95,12.45 27.91,12.45 28.65,11.71 28.65,10.95 29.39,10.95
AC2  (via drill 0.25)
  Top 0.508: C30.1 24.82,6.06 C29.1 C31.1 v25.98,6.22 | v28.83,5.92 28.83,6.53 PAD4.1
  Bottom 0.508: v25.98,6.22 27.41,6.22 27.54,6.35 28.4,6.35 v28.83,5.92
  pour Top (no thermals): 26.95,9.6 26.95,7.62 27.56,7.01 30.28,7.01 30.28,9.04 27.66,9.07 27.13,9.6
B1
  Top 0.152: ACCESSORY.1 6.79,20.54 6.97,20.72 8.36,20.72 8.61,20.48 U$1.P36
B2  (via drill 0.25)
  Top 0.152: U$1.P37 8.06,20.07 v7.98,20.16 | v3.61,20.68 3.79,20.68 3.92,20.54 ACCESSORY.2
  Bottom 0.152: v7.98,20.16 5.65,20.16 5.13,20.68 v3.61,20.68
B3
  Top 0.152: ACCESSORY.3 7.11,20.19 7.63,19.68 U$1.P38
B4  (via drill 0.25)
  Top 0.152: ACCESSORY.4 3.73,20.19 3.6,20.07 3.48,20.07 3.42,20.13 v3.17,20.13 | v6.87,19.68 7.2,19.68 7.5,19.37 8.47,19.37 8.56,19.27 U$1.P39
  Bottom 0.152: v3.17,20.13 3.42,20.13 3.48,20.07 3.91,20.07 4.09,20.24 5.13,20.24 5.52,19.85 6.69,19.85 v6.87,19.68
B5
  Top 0.152: ACCESSORY.5 6.01,19.84 6.98,18.88 U$1.P40
B6  (via drill 0.25)
  Top 0.152: U$1.P41 6.7,18.48 v6.54,18.63 | 3.73,19.76 | v3.55,19.58 3.73,19.76 | 3.73,19.76 3.81,19.84 ACCESSORY.6
  Bottom 0.152: v6.54,18.63 6.54,19.01 6,19.55 5.4,19.55 5.18,19.76 3.73,19.76 v3.55,19.58
BL
  Top 0.152: U$3.G 18.95,23.11 18.95,21.1 18.55,20.7 18.18,20.7 17.96,20.48 U$1.P7
  Top 0.203: U$3.G 21.67,23.78 21.67,22.66 22.94,21.39 23.42,21.39 24.13,20.68 R1.1
BOOT1
  Top 0.203: U8.3 26.47,13.24 26.72,13.49 C28.2
BOOT2
  Top 0.203: U8.17 25.97,7.39 C31.2
BTN_BL  (via drill 0.25)
  Top 0.152: U$8.1 2.25,7.12 R20.1 2.4,9.29 C21.1
  Top 0.203: C21.1 2.4,12.41 v2.62,12.62 | v6.64,21.07 8.47,21.07 8.74,20.81 9.18,20.81 9.2,20.83 9.63,20.83 U$1.P35
  Bottom 0.203: v2.62,12.62 2.62,15.65 0.46,17.8 0.46,19.51 1.14,20.19 1.35,20.19 2.97,21.81 2.97,21.85 3.27,22.15 3.69,22.15 3.77,22.07 5.65,22.07 v6.64,21.07
BTN_TL  (via drill 0.25)
  Top 0.203: R18.1 2.28,21.41 C19.1 3.53,22.67 3.53,23.8 | U$6.1 2.53,26.48 3.53,25.48 3.53,23.8 | 3.53,23.8 6.96,23.8 v7.14,23.62 | v8.5,23.59 8.81,23.27 U$1.P29
  Bottom 0.203: v7.14,23.62 8.47,23.62 v8.5,23.59
BTN_TR  (via drill 0.25)
  Top 0.203: U$7.1 27.75,23.84 C20.1 R19.1 24.42,23.83 22.7,25.55 20.42,25.55 v20.27,25.71 | v17.78,23.88 17.78,23.24 17.41,22.88 U$1.P13
  Bottom 0.203: v20.27,25.71 20.27,25.12 18.87,23.72 17.93,23.72 v17.78,23.88
CLK
  Top 0.152: U$1.P52 14.13,16.47 15,15.6 16.33,15.6 16.81,15.11 16.81,14.49 17.08,14.22 U4.6
CLKO
  Top 0.203: U$1.P14 16.58,24.25 18.34,26.01 18.34,27.2 18.57,27.43 18.57,28.39 U6.2
CLMP1
  Top 0.203: C26.2 25.45,12.74 U8.5
CLMP2
  Top 0.203: U8.16 25.47,8.07 24.84,7.44 C29.2
COMM1
  Top 0.203: C27.2 24.23,15.11 24.97,14.37 U8.6
COMM2
  Top 0.203: U8.15 24.97,8.16 24.8,7.99 24.29,7.99 24.14,7.84 24.14,7.79 C30.2
DM
  Top 0.203: U$1.P46 11.73,15.7 12.61,14.82 12.85,14.82 13.01,14.66 13.01,10.96 R11.2
DP
  Top 0.203: R12.2 14.72,10.65 13.96,11.41 13.69,11.41 13.36,11.73 13.36,14.81 13,15.17 12.95,15.17 12.13,15.99 U$1.P47
FOD  (via drill 0.25)
  Top 0.203: U8.14 24.47,8.7 23.96,8.19 23.37,8.19 23.11,7.92 22.99,7.92 v22.84,7.77 22.58,7.51 R23.2 R22.1
  Top 0.254: R24.1 27.67,5.69 v27.81,5.69
  Bottom 0.254: v27.81,5.69 23.27,5.69 22.84,6.12 v22.84,7.77
GND  (via drill 0.25)  (2 unrouted)
  Top 0.203: U6.3 19.45,26.83 v19.2,26.58 | U8.9 23.58,12.62 23.58,12.19 24.03,11.74 v24.03,11
  Top 0.305: R7.1 U8.9
  Bottom 0.203: X1.5 15.87,16.63 16,16.76 17.4,16.76 17.4,15.73 X1.2 | X1.14 11.37,14.67 11.43,14.61 12.19,14.61 12.37,14.78 X1.12
  other vias: 25.22,11.68 25.22,10.97 26.44,10.97 25.2,10.29 19.33,15.32 23.5,2.46 22.68,2.49 22.68,3.25 28.04,9.65 8.36,14.63 8.99,13.64 10.01,12.06 11.13,12.06 21.51,16.66 20.98,17.12 20.45,17.55 23.52,26.34 24.36,26.39 27.86,25.88 27.86,26.67 12.88,28.7 6.1,28.45 14.94,11.71 16.31,11.46 29.49,2.29 29.46,1.47 26.21,4.67 2.57,4.6 7.04,14.02 3.45,16.81 3.45,16.08 3.45,15.37 13.06,19.66 11.89,19.56 11.94,20.65 14.07,20.62 14.33,21.87 13.11,21.87 11.89,21.89 14.25,25.25 2.57,25.12 5.33,22.89 20.83,21.64 7.87,25.27 8.76,25.27 9.78,25.27 9.78,24.38 8.76,24.38 4.32,10.29 15.49,30.1
  pour Top: 27.05,11.86 28.02,11.86 28.24,11.63 28.24,9.47 28.22,9.45 27.79,9.45 27.76,9.47 27.74,9.47 27.3,9.91 27.05,9.91
  pour Bottom: -3.81,32.38 33.02,32.38 33.02,-1.91 -3.81,-1.91
  pour Top: -3.17,31.75 32.38,31.75 32.38,15.88 28.57,15.88 28.57,16.51 28.57,17.14 28.57,17.78 23.5,17.78 22.86,17.78 22.86,17.14 22.86,15.24 26.67,15.24 26.67,13.34 26.04,13.34 26.04,12.06 26.04,8.26 23.5,8.26 23.5,9.53 24.13,9.53 24.13,10.79 20.95,10.79 20.95,8.26 22.86,8.26 22.86,7.62 26.04,7.62 26.04,5.71 32.38,5.71 32.38,-1.27 -2.54,-1.27 -2.54,29.21 -3.17,29.21
INT  (via drill 0.25)
  Top 0.203: U$1.P17 14.93,25.83 v16.19,27.09 16.26,27.15 16.26,29.84 16.43,30.02 19.02,30.02 19.45,29.6 U6.6 | R17.1 v23.01,27
  Bottom 0.203: v23.01,27 22.92,27.09 v16.19,27.09
LEDK  (via drill 0.25)
  Top 0.203: v24.16,21.59 24.15,21.6 R2.2
  Bottom 0.203: X1.23 6.87,14.89 6.71,14.73 6.1,14.73 5.71,15.11 5.71,16.69 6.12,17.09 8.56,17.09 9.01,17.55 9.01,17.59 10.42,19 13.41,19 13.54,19.13 13.96,19.13 13.98,19.1 14.38,19.1 14.63,19.35 14.63,20.51 14.93,20.81 15.11,20.81 16.03,21.73 16.03,22.35 17.04,23.37 20.98,23.37 22.76,21.59 v24.16,21.59
MOSI  (via drill 0.25)
  Top 0.203: U$1.P5 17.28,19.68 v17.3,19.66
  Bottom 0.203: v17.3,19.66 16.92,19.28 16.36,19.28 16.36,18.48 15.64,17.76 15.12,17.76 14.4,17.04 13.1,17.04 13.04,17.1 12.1,17.1 11.87,16.87 X1.13
N$1
  Top 0.152: U8.13 23.97,8.83 23.66,8.52 23.23,8.52 22.97,8.26 R6.2
N$2
  Top 0.203: R3.2 20.46,12.2 U$5.A
N$3
  Top 0.152: J1.A5 13.86,5.57 14.05,5.38 14.05,4.55 13.92,4.42 9.16,4.42 R14.2
N$4
  Top 0.152: J1.B5 16.86,5.66 16.54,5.33 16.54,4.47 16.68,4.33 R13.2
N$5
  Top 0.152: R2.1 22.84,22.68 U$3.D
N$6
  Top 0.152: C17.1 10.56,27.8 Y1.3 12.35,27.18 R8.1
N$7
  Top 0.203: C23.2 8.96,8.69 U7.4
N$8
  Top 0.203: U7.5 10.75,10.34 R21.1
N$9  (via drill 0.25)
  Top 0.152: U8.12 22.94,8.74 v22.77,8.74 | v21.51,5.38 21.49,5.41 R22.2
  Bottom 0.152: v22.77,8.74 21.51,7.48 v21.51,5.38
N$10
  Top 0.254: J1.B7 14.36,7.16 | 14.36,7.16 14.36,7.18 13.31,8.23 R11.1 | J1.A7 15.29,6.33 15.29,6.88 15.01,7.16 14.36,7.16
N$11
  Top 0.254: R12.1 15.86,8 J1.B6 15.86,5.5 15.6,5.23 15.01,5.23 14.86,5.38 J1.A6
N$12
  Top 0.203: R25.2 23.53,14.99 23.53,14.92 23.79,14.66 24.11,14.66 24.47,14.29 U8.7
N$13  (via drill 0.25)
  Top 0.203: R25.1 22.54,16.08 22.53,16.08 22.38,15.93 22.38,15.12 22.53,14.97 22.76,14.97 v23.19,14.54 | v20.52,1.02 21.58,1.02 D1.C
  Bottom 0.203: v23.19,14.54 23.04,14.39 23.04,12.75 21.92,11.63 21.92,9.65 20.27,8 20.27,1.27 v20.52,1.02
N$14  (via drill 0.25)
  other vias: 13.11,20.62
QSPI_SS_N
  Top 0.152: R3.1 19.29,12.91 19.59,13.22 U4.1 21.26,13.22 21.31,13.27 21.4,13.27 21.54,13.41 21.54,15.24 19.84,16.94 16.74,16.94 16.46,17.23 U$1.P56
  Top 0.203: R5.1 R3.1
RECT  (via drill 0.25)
  Top 0.203: R24.2 26.69,7.67 26.69,7.84 26.47,8.05 U8.18
  Top 0.254: C15.1 C14.1 C34.1 29.82,5.22 v29.82,5.54 | 26.47,8.05 26.47,8.3 v26.48,8.31
  Bottom 0.254: v26.48,8.31 27.1,7.68 27.1,7.09 27.2,6.99 29.29,6.99 29.82,6.45 v29.82,5.54
RESET
  Top 0.203: U$1.P26 11.33,24.99 10.41,25.91 R4.1 5.83,26.03 U$4.A
RESET_D  (via drill 0.25)
  Top 0.152: U$1.P2 18.33,18.48 R9.1 19.29,19.43 20.09,19.43 20.7,20.04 U3.1
  Top 0.203: U3.1 21.61,20.41 v21.64,20.37 | U$1.P2 13.89,18.48 v13.75,18.62
  Bottom 0.203: v13.75,18.62 10.54,18.62 9.37,17.44 X1.18
SCK  (via drill 0.25)
  Top 0.203: v15.14,19.64 15.29,19.49 15.35,19.49 15.56,19.27 U$1.P4
  Bottom 0.203: X1.16 10.37,17.1 11.12,17.86 13.29,17.86 13.39,17.75 14.11,17.75 14.83,18.48 15.35,18.48 15.64,18.77 15.64,19.19 15.35,19.49 15.29,19.49 v15.14,19.64
SCL  (via drill 0.25)
  Top 0.203: U$1.P16 15.33,25.29 16.79,26.75 16.79,28.34 U6.8 17.33,29.52 v16.76,29.52 | R15.1 25.68,27.53 v25.7,27.51
  Bottom 0.203: v25.7,27.51 25.7,28.88 25.07,29.52 v16.76,29.52
SD0
  Top 0.152: U$1.P53 14.53,16.56 14.57,16.51 14.57,16.47 15.15,15.9 16.74,15.9 17.42,15.22 U4.5
SD1
  Top 0.152: U$1.P55 15.33,16.67 15.49,16.51 19.76,16.51 21.18,15.09 21.18,13.92 20.98,13.72 U4.2
SD2
  Top 0.152: U4.3 20.75,14.22 20.78,14.25 20.78,14.94 19.51,16.2 15.3,16.2 14.93,16.57 U$1.P54
SD3
  Top 0.152: U$1.P51 13.73,16.41 14.85,15.29 15.98,15.29 16.46,14.81 16.46,14.34 16.66,14.14 16.66,13.95 16.89,13.72 U4.7
SDA  (via drill 0.25)
  Top 0.203: U$1.P15 15.73,24.24 17.65,26.16 v17.65,27.64 U6.1 | R16.1 v24.36,27.51
  Bottom 0.203: v24.36,27.51 17.78,27.51 v17.65,27.64
TERM
  Top 0.203: U8.10 21.93,11.75 R7.2
TFT_CS  (via drill 0.25)
  Top 0.152: 18.05,19.16 | R10.1 18.57,19.69 18.05,19.16 | U$1.P3 17.76,18.88 18.05,19.16
  Top 0.203: v15.14,18.98 15.24,18.88 U$1.P3
  Bottom 0.203: X1.17 9.87,17.16 10.08,17.37 10.08,17.66 10.64,18.21 13.44,18.21 13.54,18.11 13.96,18.11 14.26,18.41 14.26,18.47 14.77,18.98 v15.14,18.98
TFT_DC  (via drill 0.25)
  Top 0.203: v15.14,20.3 15.29,20.15 15.35,20.15 15.42,20.07 U$1.P6
  Bottom 0.203: X1.15 10.87,17.09 11.25,17.48 13.17,17.48 13.24,17.4 14.25,17.4 14.97,18.12 15.49,18.12 16,18.62 16,19.34 15.64,19.7 15.64,19.85 15.35,20.15 15.29,20.15 v15.14,20.3
TFT_PWR  (via drill 0.25)
  Top 0.203: U7.3 7.11,8.85 v6.98,8.72 | v8.77,22.38 9.07,22.07 U$1.P32
  Bottom 0.203: v6.98,8.72 6.98,12.61 4.7,14.88 4.57,14.88 4.57,17.22 5.08,17.73 7.82,17.73 9.25,19.15 9.25,21.9 v8.77,22.38
VBAT  (via drill 0.25)
  Top 0.203: U8.4 25.97,13.73 v26.01,13.77
  Top 0.254: C32.1 C33.1 25.92,2.97 26.2,2.97 27.64,1.54 BAT_POS.1 28.12,0.94 v28.5,0.94 | D1.A v24.28,0.94
  Top 0.406: v25.78,17.7 25.93,17.86 U5.3
  Bottom 0.203: v26.01,13.77 25.91,13.66 23.8,13.66
  Bottom 0.254: v24.28,0.94 v28.5,0.94
  Bottom 0.406: v28.5,0.94 28.5,1.7 26.19,4.01 21.46,4.01 20.83,4.65 20.83,7.75 22.43,9.35 v22.43,9.63 22.43,11.33 23.8,12.7 23.8,13.66 23.8,14.79 23.44,15.15 23.14,15.15 23.14,16.69 24.15,17.7 v25.78,17.7
  pour Top (no thermals): 23.36,10.2 23.36,10.36 21.26,10.36 21.26,9.07 22.23,9.07
VUSB  (via drill 0.25)
  Top 0.305: J1.VBUS1 12.66,5.61 12.85,5.42 12.85,5.33 v13.03,5.16 | v17.22,5.13 17.37,5.28 17.37,5.42 17.56,5.61 J1.VBUS2 | U5.1 29.49,17.58 29.13,17.93 v29.06,17.93
  Bottom 0.305: 17.2,5.16 v13.03,5.16 13.03,4.8 11.56,3.33 9.83,3.33 8.96,2.46 U$2.2 | 17.2,5.16 v17.22,5.13 | v29.06,17.93 28.73,17.93 28.4,18.26 23.99,18.26 22.63,16.91 22.63,12.92 21.51,11.8 21.51,9.82 18.63,6.93 17.78,6.93 17.2,6.35 17.2,5.16
  other vias: 8.96,1.24
XIN
  Top 0.152: U$1.P20 13.73,25.62 15.14,27.03 15.14,27.72 15.48,28.06 | 15.48,28.06 C16.1 | Y1.1 15.48,28.15 15.48,28.06
XOUT
  Top 0.152: U$1.P21 13.33,26.37 R8.2

### Text on the board
tPlace: BTN TR | RESET | BTN TL | RP Watchy | AC1 | BOOT | AC2 | BTN BL | VB+
bPlace: 1.3" TFT / 3 BTNs / 1 RP2040 / 2MB FLASH